# Altium project Motor_Driver.PrjPCB
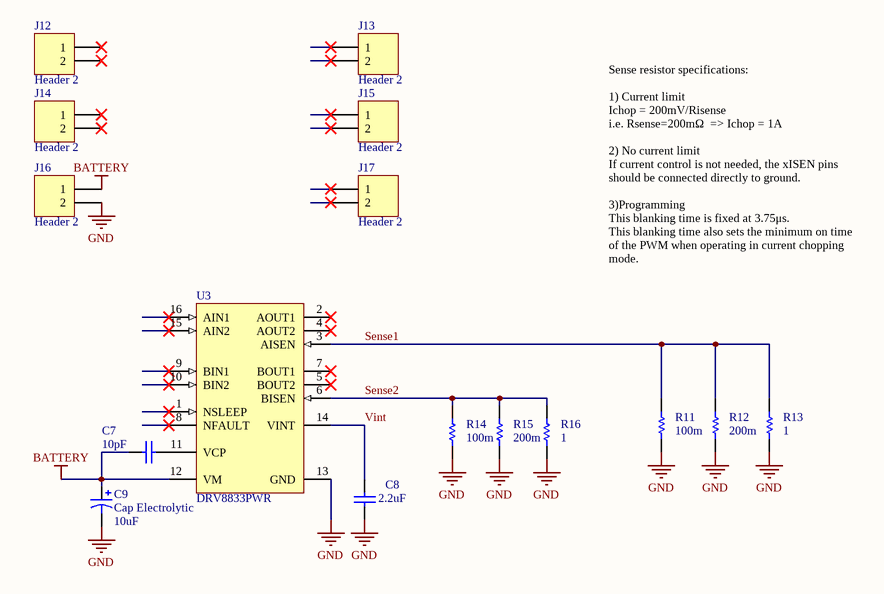
[diagram p0: Motor_Driver.SchDoc]
1 sheet, 16 parts. Net scope: global (net labels, ports and power ports of the same name join across sheets).
Board file: Motor_Driver.PcbDoc

## Sheet Motor_Driver.SchDoc
size A

### Parts
C7  value 10pF  [6-0805_M]  (hidden comment: cap)
C8  value 2.2uF  [6-0805_M]  (hidden comment: cap)
C9  Cap Electrolytic  value 10uF  [capacitor_3d]
J12  Header 2  [HDR1X2]
J13  Header 2  [HDR1X2]
J14  Header 2  [HDR1X2]
J15  Header 2  [HDR1X2]
J16  Header 2  [HDR1X2]
J17  Header 2  [HDR1X2]
R11  value 100m  [6-0805_M]  (hidden comment: Res1)
R12  value 200m  [6-0805_M]  (hidden comment: Res1)
R13  value 1  [6-0805_M]  (hidden comment: Res1)
R14  value 100m  [6-0805_M]  (hidden comment: Res1)
R15  value 200m  [6-0805_M]  (hidden comment: Res1)
R16  value 1  [6-0805_M]  (hidden comment: Res1)
U3  DRV8833PWR  [TI-PW16_M]

### Nets
BATTERY: C7.2 C9.1 J16.1 U3.12(VM)
GND: C8.1 C9.2 J16.2 R11.1 R12.1 R13.1 R14.1 R15.1 R16.1 U3.13(GND)
Sense1: R11.2 R12.2 R13.2 U3.3(AISEN)
Sense2: R14.2 R15.2 R16.2 U3.6(BISEN)
Vint: C8.2 U3.14(VINT)
NetC7_1: C7.1 U3.11(VCP)

Not connected (* = marked no-connect by the designer): J12 1* 2*; J13 1* 2*; J14 1* 2*; J15 1* 2*; J17 1* 2*; U3 1(NSLEEP)* 2(AOUT1)* 4(AOUT2)* 5(BOUT2)* 7(BOUT1)* 8(NFAULT)* 9(BIN1)* 10(BIN2)* 15(AIN2)* 16(AIN1)*

### Notes on the sheet
- Sense resistor specifications:
  1) Current limit
  Ichop = 200mV/Risense
  i.e. Rsense=200mΩ  => Ichop = 1A
  2) No current limit
  If current control is not needed, the xISEN pins should be connected directly to ground.
  3)Programming
  This blanking time is fixed at 3.75μs.
  This blanking time also sets the minimum on time of the PWM when operating in current chopping mode.

### Library data of the parts
C7 C8 = cap: Capacitor; Published: 8-Jun-2000; LatestRevisionDate: 17-Jul-2002; LatestRevisionNote: Re-released for DXP Platform.; PackageReference: RAD-0.3; Publisher: Altium Limited; PackageDescription: Radial Cap, Thru-Hole; 2 Leads; 0.3 in Pin Spacing; Supplier 1: Digikey
  C7: Supplier Part Number 1: 399-9147-1-ND
  C8: Supplier Part Number 1: 490-3906-1-ND
C9 = Cap Pol1: Polarized Capacitor (Radial); Published: 8-Jun-2000; LatestRevisionDate: 17-Jul-2002; LatestRevisionNote: Re-released for DXP Platform.; PackageReference: RB7.6-15; Publisher: Altium Limited; PackageDescription: Polarized Capacitor (Radial); 2 Leads; Supplier Part Number 1: 493-2099-1-ND; Supplier 1: Digikey
J12-J17 = Header 2: Header, 2-Pin; LatestRevisionDate: 17-Jul-2002; LatestRevisionNote: Re-released for DXP Platform.; Publisher: Altium Limited; Supplier Part Number 1: A1921-ND; Supplier 1: Digikey
R11-R16 = Res1: Resistor; Published: 8-Jun-2000; LatestRevisionDate: 17-Jul-2002; LatestRevisionNote: Re-released for DXP Platform.; PackageReference: AXIAL-0.3; Publisher: Altium Limited; PackageDescription: Axial Device, Thru-Hole; 2 Leads; 0.3 in Pin Spacing; Supplier Part Number 1: 73L3R20JCT-ND; Supplier 1: Digikey
U3 = CMP-1529-00001-1: 2 A Low Voltage Dual Brushed DC or Single Bipolar Stepper Motor Driver (PWM Ctrl), 2.7 to 10.8 V, -40 to 85 degC, 16-Pin SOP (PW), Green (RoHS & no Sb/Br), Tape and Reel; Manufacturer: Texas Instruments; Vs: 2.7 V Min.; RMS Output Current: 1.5 A; Peak Output Current: 2 A; rDS (ON) (LS + HS): 360 mOhms; ComponentLink1URL: www.ti.com; Temperature Range: -40 to 85 degC; ComponentLink2Description: Datasheet; PackageVersion: 4040064-4/G; ComponentLink3URL: http://www.ti.com/lit/ml/mpds361/mpds361.pdf; PartNumber: DRV8833PWR; Control I/F: PWM; ComponentLink1Description: Manufacturer URL; ComponentLink3Description: Package Specification; PackageDescription: 16-Pin Plastic Small Outline, Body 4.4 x 5 mm, Pitch 0.65 mm; Mounting Technology: Surface Mount; Eco-Plan: Green (RoHS & no Sb/Br); DatasheetVersion: SLVSAR1D; ComponentLink2URL: http://www.ti.com/lit/ds/symlink/drv8833.pdf; Packing: Tape and Reel; Supplier 1: Digikey; Supplier Part Number 1: 296-40080-1-ND